# EasyEDA Pro project placa_pcb.epro

# Board Placa_25
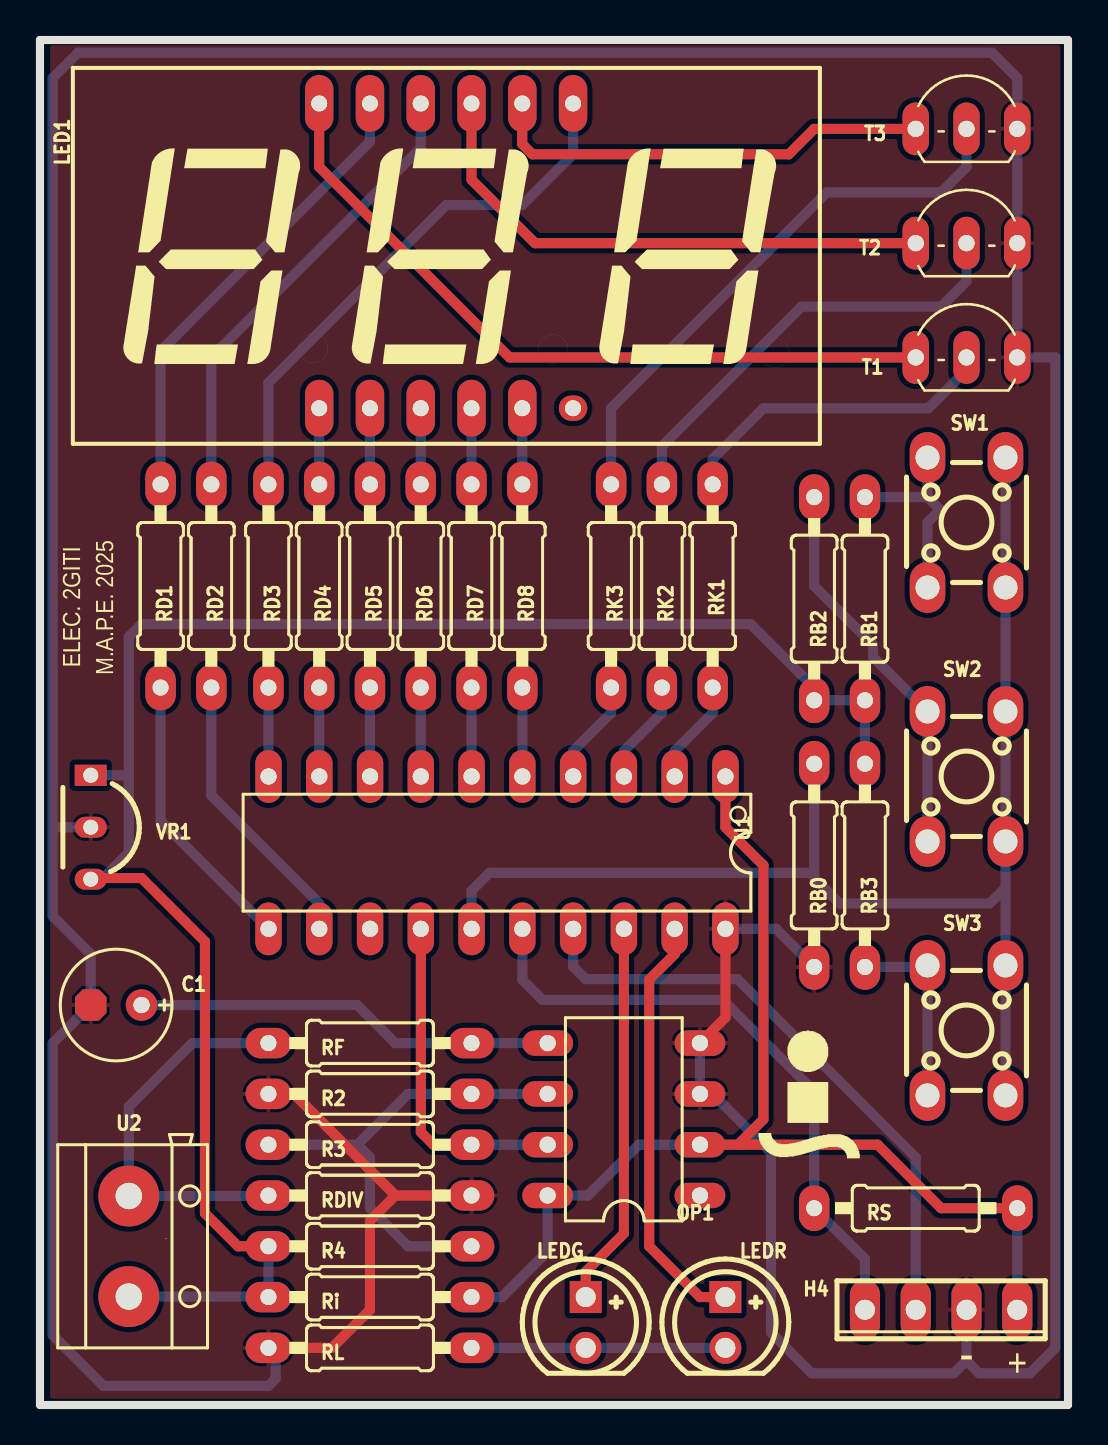
[diagram p0: board, top side]
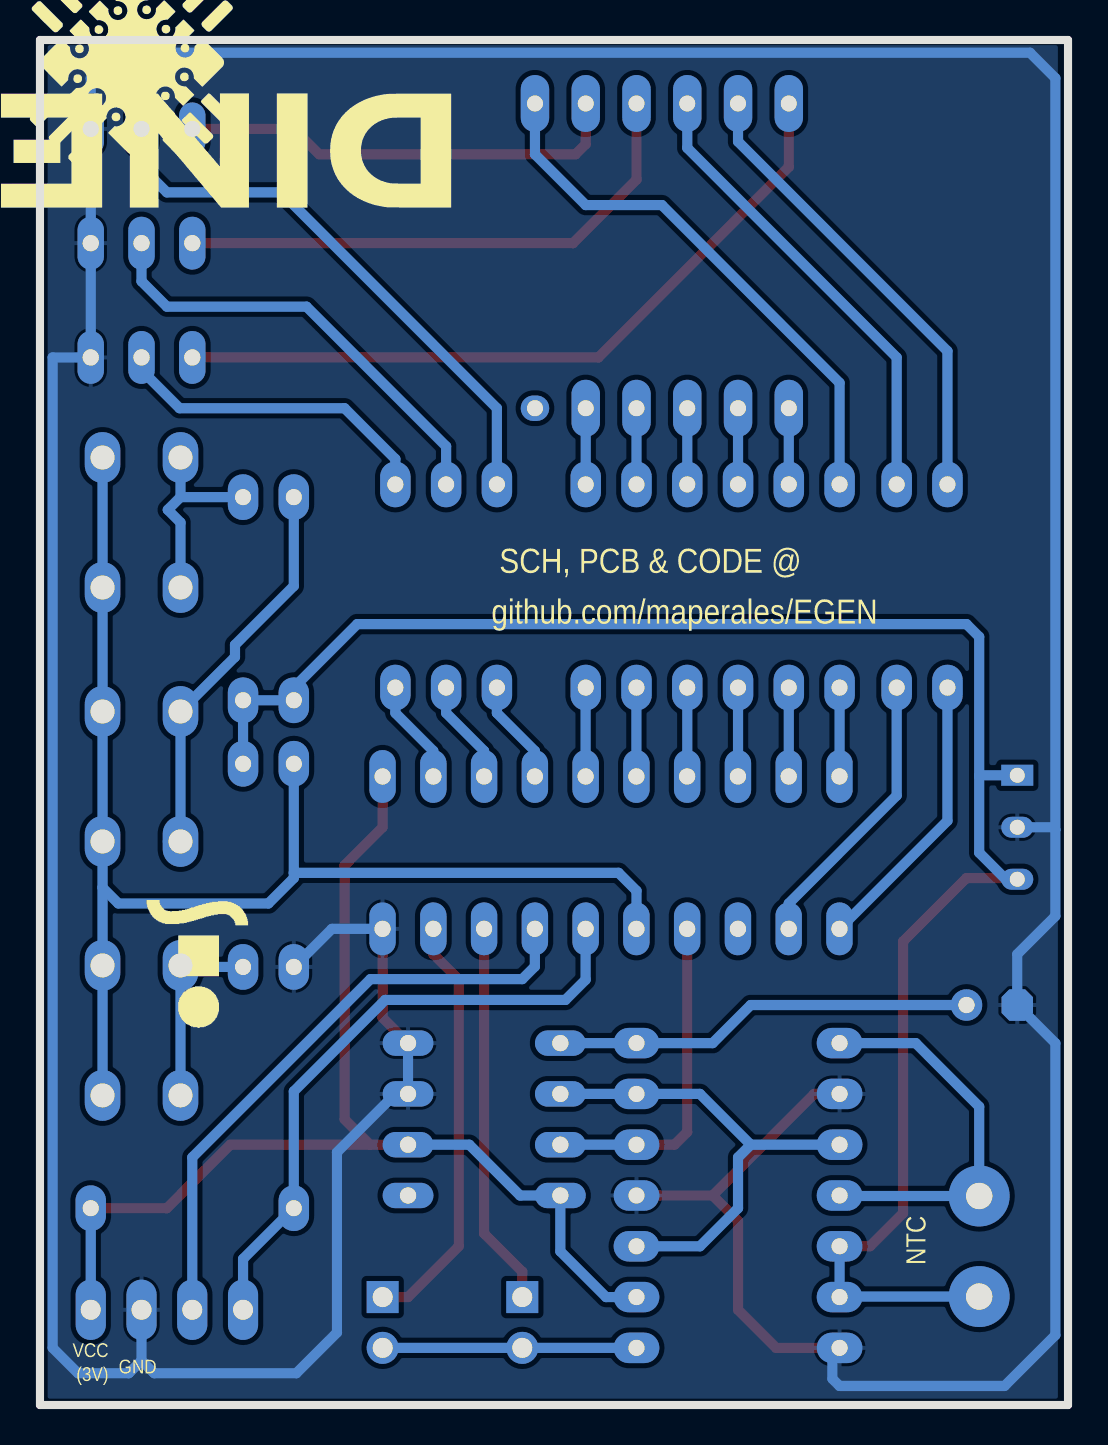
[diagram p1: board, bottom side, seen from below]

Outline 51.44 x 68.26 mm; copper layers: Top Layer, Bottom Layer. Coordinates in mm from the lower left corner of the outline.
Outline path: 0,68.26 51.44,68.26 51.44,0 0,0 0,68.26
Stack: Top Layer 0.035mm / Dielectric1 1.51mm FR4 er 4.5 / Bottom Layer 0.035mm

## Design rules (mm)
spacing safeClearance (default): track to track 0.152, other pairs 0 to 0.254
track width trackWidth (default): min 0.003, default 0.003, max 2.54
differential pair differentialPair (default): width min 0.127, default 0.254, max 2.54; gap min 0.152, default 0.152
via viaSize (default): diameter min 0, default 0, max 2.6; hole min 0, default 0, max 2
net GND uses CopperRegion1

## Placement (name value [footprint] x y rotation side)
C1  1u  [E2,5-6E]  3.81 20 180 top
H4  -  [4POL254]  45.09 4.76 180 top
LED1  B?56-12EWAA  [BX56-12]  20.32 57.47 0 top
LEDG  -  [LED-TH_BD5.8-P2.54-FD]  27.31 4.13 270 top
LEDR  -  [LED-TH_BD5.8-P2.54-FD]  34.29 4.13 270 top
OP1  MCP6242  [DIL8_MOD]  29.21 16.83 90 top
R2  56k  [RESISTOR 1/4W]  16.51 15.56 0 top
R3  33k  [RESISTOR 1/4W]  16.51 13.02 180 top
R4  120k  [RESISTOR 1/4W]  16.51 7.94 0 top
RB0  33k  [RESISTOR 1/4W]  38.73 26.99 90 top
RB1  33k  [RESISTOR 1/4W]  41.28 40.32 270 top
RB2  56k  [RESISTOR 1/4W]  38.73 40.32 270 top
RB3  120k  [RESISTOR 1/4W]  41.28 26.99 90 top
RD1  220  [RESISTOR 1/4W]  6.03 40.96 90 top
RD2  220  [RESISTOR 1/4W]  8.57 40.96 90 top
RD3  220  [RESISTOR 1/4W]  11.43 40.96 90 top
RD4  220  [RESISTOR 1/4W]  13.97 40.96 90 top
RD5  220  [RESISTOR 1/4W]  16.51 40.96 90 top
RD6  220  [RESISTOR 1/4W]  19.05 40.96 90 top
RD7  220  [RESISTOR 1/4W]  21.59 40.96 90 top
RD8  220  [RESISTOR 1/4W]  24.13 40.96 90 top
RDIV  33k  [RESISTOR 1/4W]  16.51 10.48 0 top
RF  56k  [RESISTOR 1/4W]  16.51 18.1 180 top
Ri  220  [RESISTOR 1/4W]  16.51 5.4 180 top
RK1  4k7  [RESISTOR 1/4W]  33.66 40.96 90 top
RK2  4k7  [RESISTOR 1/4W]  31.12 40.96 90 top
RK3  4k7  [RESISTOR 1/4W]  28.57 40.96 90 top
RL  330  [RESISTOR 1/4W]  16.51 2.86 0 top
RS  4k7  [RESISTOR 1/4W#2]  43.81 9.84 180 top
SW1  -  [KEY-TH_4P-L6.0-W6.0-P3.90-LS6.5]  46.35 44.13 270 top
SW2  -  [KEY-TH_4P-L6.0-W6.0-P3.90-LS6.5]  46.35 31.43 270 top
SW3  -  [KEY-TH_4P-L6.0-W6.0-P3.90-LS6.5]  46.35 18.73 270 top
T1  BC548  [TO92-EBC]  46.35 53.66 0 top
T2  BC548  [TO92-EBC]  46.35 59.37 0 top
T3  BC548  [TO92-EBC]  46.35 65.09 0 top
U1  MSP430G2232IN20  [N20]  22.86 27.62 180 top
U2  -  [AK500/2]  4.44 7.94 270 top
VR1  TL431CLP  [TO93_VR]  2.54 28.89 270 top

## Footprints (pads in the part's own frame, mm; a bottom-side part is the same pattern mirrored in y, then rotated)
4POL254
  oval 1.508x3.016 hole 1: 1(-3.81,0) 2(-1.27,0) 3(1.27,0) 4(3.81,0)
AK500/2
  oval 3.048x3.048 hole 1.321: 1(-2.514,0) 2(2.514,0)
BX56-12
  oval 1.423x2.845 hole 0.8: 1(-6.35,-7.62) 2(-3.81,-7.62) 3(-1.27,-7.62) 4(1.27,-7.62) 5(3.81,-7.62) 7(6.35,7.62) 8(3.81,7.62) 9(1.27,7.62) 10(-1.27,7.62) 11(-3.81,7.62) 12(-6.35,7.62)
  oval 1.423x1.27 hole 0.8: 6(6.35,-7.62)
DIL8_MOD
  oval 1.27x2.54 hole 0.813: 1(-6.35,-3.81) 2(-3.81,-3.81) 3(-1.27,-3.81) 4(1.27,-3.81) 5(1.27,3.81) 6(-1.27,3.81) 7(-3.81,3.81) 8(-6.35,3.81)
E2,5-6E
  round 1.575 hole 0.813: +(-1.27,0)
  custom 1.575x1.575 hole 0.813: -(1.27,0)
KEY-TH_4P-L6.0-W6.0-P3.90-LS6.5
  oval 2.54x1.778 hole 1.2x1.016: 1(-3.25,1.95) 2(3.25,1.95) 3(-3.25,-1.95) 4(3.25,-1.95)
LED-TH_BD5.8-P2.54-FD
  rect 1.6x1.6 hole 1: 1(-1.27,0)
  round 1.6 hole 1: 2(1.27,0)
N20
  oval 1.321x2.642 hole 0.813: 1(-11.435,-3.81) 2(-8.895,-3.81) 3(-6.355,-3.81) 4(-3.815,-3.81) 5(-1.275,-3.81) 6(1.265,-3.81) 7(3.805,-3.81) 8(6.345,-3.81) 9(8.885,-3.81) 10(11.425,-3.81) 11(11.425,3.81) 12(8.885,3.81) 13(6.345,3.81) 14(3.805,3.81) 15(1.265,3.81) 16(-1.275,3.81) 17(-3.815,3.81) 18(-6.355,3.81) 19(-8.895,3.81) 20(-11.435,3.81)
RESISTOR 1/4W
  oval 2.286x1.524 hole 0.805x0.8: 1(-5.08,0) 2(5.08,0)
RESISTOR 1/4W#2
  oval 1.524x2.286 hole 0.805x0.8: 1(-5.08,0)
  oval 1.524x2.286 hole 0.8: 2(5.08,0)
TO92-EBC
  oval 1.321x2.642 hole 0.813: B(0,-1.27) C(-2.54,-1.27) E(2.54,-1.27)
TO93_VR
  oval 1.05x1.6 hole 0.75: A(0,0) C(2.6,0)
  rect 1.05x1.6 hole 0.75: R(-2.6,0)

## Nets
GND: C1.- H4.2 OP1.3 OP1.4 R2.1 RB0.1 RDIV.2 RL.1 T1.E T2.E T3.E U1.20 VR1.A
VCC: H4.1 OP1.2 OP1.8 Ri.1 RS.1 U1.1
ADCIN: OP1.7 R3.1 U1.14
BOTONES: RB0.2 SW1.1 SW1.2 SW2.1 SW2.2 SW3.1 SW3.2 U1.15
DP: LED1.3 RD6.2
K1: RK1.1 U1.2
K2: RK2.1 U1.3
K3: RK3.1 U1.4
N$13: OP1.6 R2.2 R3.2 R4.2
N$15: RDIV.1 RF.2 U2.1
N$17: C1.+ OP1.5 RF.1
RESET: H4.4 RS.2 U1.16
S-A: LED1.11 RD1.2
S-B: LED1.7 RD3.2
S-C: LED1.4 RD7.2
S-D: LED1.2 RD5.2
S-E: LED1.1 RD4.2
S-F: LED1.10 RD2.2
S-G: LED1.5 RD8.2
TST: H4.3 U1.17
VREF: R4.1 RB1.2 RB2.2 RB3.2 Ri.2 U2.2 VR1.C VR1.R
$2N265: RB2.1 SW2.3 SW2.4
$2N269: RB3.1 SW3.3 SW3.4
$2N273: RB1.1 SW1.3 SW1.4
$2N990: RK1.2 T1.B
$2N992: RK2.2 T2.B
$2N994: RK3.2 T3.B
$2N1025: RD2.1 U1.12
$2N1029: RD1.1 U1.11
$2N1033: RD3.1 U1.10
$2N1039: RD4.1 U1.9
$2N1045: RD5.1 U1.8
$2N1090: LEDG.2 LEDR.2 RL.2
$2N1102: RD6.1 U1.7
$2N1103: RD8.1 U1.5
$2N1104: RD7.1 U1.6
$2N1439: LED1.8 T3.C
$2N1845: LED1.9 T2.C
$2N1849: LED1.12 T1.C
$2N1982: LEDR.1 U1.19
$2N1988: LEDG.1 U1.18

Pads without a net: LED1 6; OP1 1; U1 13

## Routing (per net, layer and track width the routed paths; a pad name or vN(x,y) marks a point on that pad's centre or on a via; arc(x,y) is an arc through that point)
GND: length 266
  Top Layer w0.508: RDIV.2 17.78,10.48 ; 17.78,10.48 12.7,15.56 R2.1 ; 17.78,10.48 16.51,9.21 16.51,4.76 14.6,2.86 RL.1 ; U1.20 34.29,19.37 OP1.4
  Bottom Layer w0.508: 46.35,2.22 46.99,1.59 49.53,1.59 50.8,2.86 50.8,52.39 T1.E T2.E 48.9,66.36 47.62,67.63 1.91,67.63 0.63,66.36 0.63,28.77 ; 46.35,2.22 H4.2 ; 46.35,2.22 45.72,1.59 38.61,1.59 36.58,3.62 36.58,12.64 33.66,15.56 OP1.3 OP1.4 ; RL.1 11.79,2.5 11.79,1.31 11.43,0.95 3.17,0.95 0.63,3.49 0.63,18.1 C1.- 2.54,22.54 0.63,24.45 0.63,28.77 ; 0.63,28.77 0.76,28.89 VR1.A ; U1.20 36.83,23.81 RB0.1
VCC: length 58.2
  Top Layer w0.508: 34.92,13.02 36.19,14.29 36.19,26.99 34.29,28.89 U1.1 ; 34.92,13.02 OP1.2 ; 34.92,13.02 41.91,13.02 45.09,9.84 RS.1
  Bottom Layer w0.508: Ri.1 23.11,5.4 25.4,7.68 OP1.8 27.42,10.48 29.96,13.02 OP1.2 ; H4.1 RS.1
ADCIN: length 16.8
  Top Layer w0.508: U1.14 19.06,13.65 19.69,13.02 R3.1
  Bottom Layer w0.508: R3.1 OP1.7
BOTONES: length 67.5
  Bottom Layer w0.508: 48.31,25.87 SW2.2 SW2.1 SW1.2 SW1.1 ; 48.31,25.87 47.52,25.08 40,25.08 38.73,26.35 38.73,26.61 ; 48.31,25.87 SW3.1 SW3.2 ; RB0.2 38.73,26.61 ; 38.73,26.61 22.49,26.61 21.59,25.72 21.59,23.82 U1.15
DP: length 4.3
  Bottom Layer w0.508: RD6.2 LED1.3 18.73,50.17
K1: length 5.2
  Bottom Layer w0.508: U1.2 31.75,32.71 33.66,34.61 RK1.1
K2: length 5.2
  Bottom Layer w0.508: RK2.1 31.12,34.61 29.22,32.71 U1.3
K3: length 5.2
  Bottom Layer w0.508: RK3.1 28.57,34.61 26.67,32.71 U1.4
N$13: length 24.3
  Bottom Layer w0.508: R4.2 18.41,7.94 16.51,9.84 16.51,12.38 15.88,13.02 ; 15.88,13.02 R3.2 ; 15.88,13.02 18.41,15.56 R2.2 OP1.6
N$15: length 19.8
  Bottom Layer w0.508: RDIV.1 11.4,10.45 U2.1 4.44,14.92 7.62,18.1 RF.2
N$17: length 21.1
  Bottom Layer w0.508: OP1.5 RF.1 17.78,18.1 15.88,20 5.08,20
RESET: length 31.4
  Bottom Layer w0.508: H4.4 41.28,7.3 RS.2 38.73,15.68 34.16,20.26 25.15,20.26 24.13,21.27 U1.16
S-A: length 23.4
  Bottom Layer w0.508: RD1.2 6.03,52.7 16.51,63.18 LED1.11
S-B: length 28
  Bottom Layer w0.508: RD3.2 11.43,51.12 20.32,60.01 24.13,60.01 26.67,62.55 LED1.7 26.35,65.41
S-C: length 4.3
  Bottom Layer w0.508: RD7.2 LED1.4 21.27,50.17
S-D: length 4.3
  Bottom Layer w0.508: 16.19,50.17 LED1.2 RD5.2
S-E: length 4.3
  Bottom Layer w0.508: RD4.2 LED1.1 13.65,50.17
S-F: length 23.8
  Bottom Layer w0.508: 18.73,65.41 LED1.10 19.05,62.87 8.57,52.39 RD2.2
S-G: length 4.3
  Bottom Layer w0.508: RD8.2 LED1.5 23.81,50.17
TST: length 30.6
  Bottom Layer w0.508: U1.17 26.67,21.93 27.31,21.3 34.9,21.3 43.81,12.38 H4.3
VREF: length 91.4
  Top Layer w0.508: VR1.C 2.6,26.35 5.08,26.35 8.25,23.18 8.25,9.59 9.91,7.94 R4.1
  Bottom Layer w0.508: 4.44,31.44 4.44,27.62 3.12,26.29 VR1.C ; 4.44,31.44 4.44,38.42 5.08,39.05 35.56,39.05 38.73,35.88 RB2.2 RB1.2 RB3.2 ; 4.44,31.44 4.39,31.49 VR1.R ; R4.1 Ri.2 11.4,5.42 U2.2
$2N265: length 19.8
  Bottom Layer w0.508: 45.04,28.18 44.41,28.82 SW2.3 41.68,37.41 41.68,38.01 38.73,40.96 RB2.1
$2N269: length 9.7
  Bottom Layer w0.508: SW3.4 SW3.3 44.33,21.91 RB3.1
$2N273: length 10.2
  Bottom Layer w0.508: SW1.4 44.41,44.13 45.04,44.77 44.41,45.4 ; 44.41,45.4 RB1.1 ; 44.41,45.4 SW1.3
$2N990: length 16.4
  Bottom Layer w0.508: T1.B 46.35,51.75 44.45,49.85 36.19,49.85 33.66,47.31 RK1.2
$2N992: length 22.5
  Bottom Layer w0.508: T2.B 46.35,56.2 45.09,54.93 38.1,54.93 31.12,47.94 RK2.2
$2N994: length 28.5
  Bottom Layer w0.508: 46.35,63.82 46.35,61.91 45.09,60.64 39.37,60.64 28.57,49.85 RK3.2
$2N1025: length 14.3
  Bottom Layer w0.508: RD2.1 8.57,30.48 13.97,25.08 U1.12
$2N1029: length 14.3
  Bottom Layer w0.508: U1.11 6.03,29.22 RD1.1
$2N1033: length 4.4
  Bottom Layer w0.508: RD3.1 11.43,31.44 U1.10
$2N1039: length 4.4
  Bottom Layer w0.508: U1.9 13.97,31.44 RD4.1
$2N1045: length 4.4
  Bottom Layer w0.508: U1.8 16.51,31.44 RD5.1
$2N1090: length 12.7
  Bottom Layer w0.508: LEDR.2 LEDG.2 RL.2
$2N1102: length 4.4
  Bottom Layer w0.508: RD6.1 19.05,31.44 U1.7
$2N1103: length 4.4
  Bottom Layer w0.508: U1.5 24.13,35.87 RD8.1
$2N1104: length 4.4
  Bottom Layer w0.508: RD7.1 21.59,35.87 U1.6
$2N1439: length 22.5
  Top Layer w0.508: 43.81,63.82 38.73,63.82 37.47,62.55 24.64,62.55 24.13,63.06 LED1.8
$2N1845: length 27.4
  Top Layer w0.508: T2.C 24.76,58.1 21.59,61.28 LED1.9
$2N1849: length 37
  Top Layer w0.508: LED1.12 13.97,61.91 23.5,52.39 T1.C
$2N1982: length 21.3
  Top Layer w0.508: LEDR.1 33.02,5.4 30.48,7.94 30.48,21.27 31.75,22.55 U1.19
$2N1988: length 19.2
  Top Layer w0.508: LEDG.1 27.31,6.67 29.22,8.58 U1.18

## Copper pours and planes (outline as drawn; the poured copper is in the pictures)
GND on Top Layer: 0.51,68.01 51.05,68.01 51.05,0.32 0.51,0.32
GND on Bottom Layer: 0.51,68.01 51.05,68.01 51.05,0.32 0.51,0.32

## Text on the board
Bottom Silkscreen Layer: GND | VCC / (3V) | NTC | github.com/maperales/EGEN | SCH, PCB & CODE @
Top Silkscreen Layer: ELEC. 2GITI | M.A.P.E. 2025 | + | -
